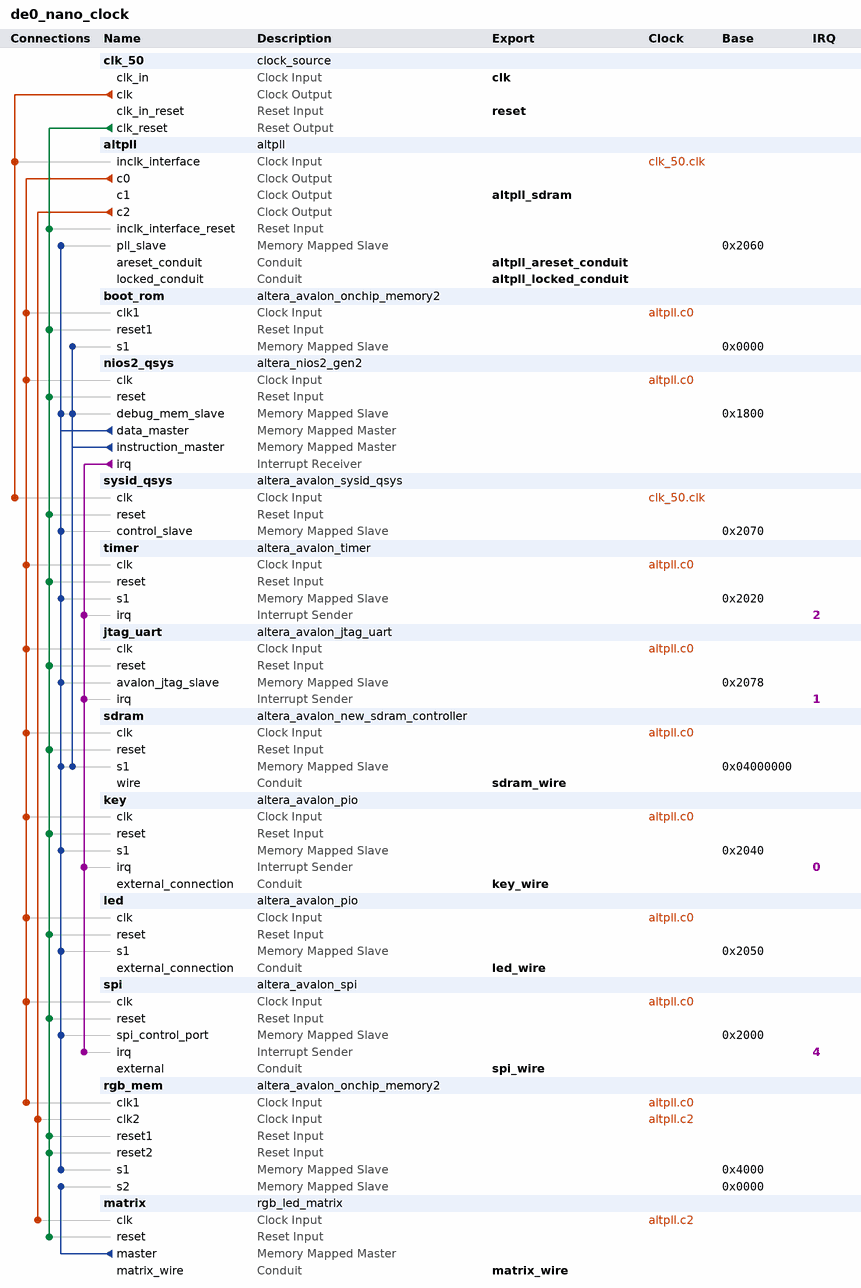
[diagram p0: system contents]
# Platform Designer (Qsys) system de0_nano_clock, Cyclone IV E EP4CE22F17C6
# Parameters at their usual value, and those the tool derives, are not listed.
package require -exact qsys 17.1
create_system de0_nano_clock
set_project_property DEVICE_FAMILY {Cyclone IV E}
set_project_property DEVICE EP4CE22F17C6

add_instance clk_50 clock_source 17.1
set_instance_parameter_value clk_50 clockFrequency 50000000

add_instance altpll altpll 17.1
set_instance_parameter_value altpll CLK0_DIVIDE_BY 2
set_instance_parameter_value altpll CLK0_MULTIPLY_BY 5
set_instance_parameter_value altpll CLK1_DIVIDE_BY 2
set_instance_parameter_value altpll CLK1_DUTY_CYCLE 50
set_instance_parameter_value altpll CLK1_MULTIPLY_BY 5
set_instance_parameter_value altpll CLK1_PHASE_SHIFT 1333
set_instance_parameter_value altpll CLK2_DIVIDE_BY 1
set_instance_parameter_value altpll CLK2_DUTY_CYCLE 50
set_instance_parameter_value altpll CLK2_MULTIPLY_BY 5
set_instance_parameter_value altpll CLK2_PHASE_SHIFT 0
set_instance_parameter_value altpll INCLK0_INPUT_FREQUENCY 20000
set_instance_parameter_value altpll PORT_ARESET PORT_USED
set_instance_parameter_value altpll PORT_LOCKED PORT_USED
set_instance_parameter_value altpll PORT_clk1 PORT_USED
set_instance_parameter_value altpll PORT_clk2 PORT_USED
set_instance_parameter_value altpll PORT_clk3 PORT_UNUSED

add_instance boot_rom altera_avalon_onchip_memory2 17.1
set_instance_parameter_value boot_rom dataWidth 32
set_instance_parameter_value boot_rom dualPort false
set_instance_parameter_value boot_rom initMemContent true
set_instance_parameter_value boot_rom initializationFileName onchip_mem.hex
set_instance_parameter_value boot_rom memorySize 4096
set_instance_parameter_value boot_rom writable false

add_instance nios2_qsys altera_nios2_gen2 17.1
set_instance_parameter_value nios2_qsys dcache_size 2048
set_instance_parameter_value nios2_qsys dividerType srt2
set_instance_parameter_value nios2_qsys exceptionSlave sdram.s1
set_instance_parameter_value nios2_qsys icache_size 4096
set_instance_parameter_value nios2_qsys impl Fast
set_instance_parameter_value nios2_qsys mmu_TLBMissExcSlave sdram.s1
set_instance_parameter_value nios2_qsys mmu_enabled true
set_instance_parameter_value nios2_qsys resetSlave boot_rom.s1

add_instance sysid_qsys altera_avalon_sysid_qsys 17.1
set_instance_parameter_value sysid_qsys id 0

add_instance timer altera_avalon_timer 17.1
set_instance_parameter_value timer period 1
set_instance_parameter_value timer periodUnits MSEC

add_instance jtag_uart altera_avalon_jtag_uart 17.1
set_instance_parameter_value jtag_uart simInteractiveOptions NO_INTERACTIVE_WINDOWS

add_instance sdram altera_avalon_new_sdram_controller 17.1
set_instance_parameter_value sdram TAC 5.5
set_instance_parameter_value sdram TRCD 20.0
set_instance_parameter_value sdram TRP 20.0
set_instance_parameter_value sdram casLatency 3
set_instance_parameter_value sdram columnWidth 9
set_instance_parameter_value sdram dataWidth 16
set_instance_parameter_value sdram generateSimulationModel false
set_instance_parameter_value sdram model single_Micron_MT48LC4M32B2_7_chip
set_instance_parameter_value sdram numberOfBanks 4
set_instance_parameter_value sdram numberOfChipSelects 1
set_instance_parameter_value sdram powerUpDelay 100.0
set_instance_parameter_value sdram refreshPeriod 15.625
set_instance_parameter_value sdram rowWidth 13

add_instance key altera_avalon_pio 17.1
set_instance_parameter_value key captureEdge true
set_instance_parameter_value key direction Input
set_instance_parameter_value key edgeType FALLING
set_instance_parameter_value key generateIRQ true
set_instance_parameter_value key irqType EDGE
set_instance_parameter_value key width 2

add_instance led altera_avalon_pio 17.1
set_instance_parameter_value led direction Output
set_instance_parameter_value led width 8

add_instance spi altera_avalon_spi 17.1
set_instance_parameter_value spi clockPolarity 0
set_instance_parameter_value spi dataWidth 8
set_instance_parameter_value spi masterSPI true
set_instance_parameter_value spi numberOfSlaves 1
set_instance_parameter_value spi targetClockRate 20000000

add_instance rgb_mem altera_avalon_onchip_memory2 17.1
set_instance_parameter_value rgb_mem dataWidth 32
set_instance_parameter_value rgb_mem dualPort true
set_instance_parameter_value rgb_mem enableDiffWidth true
set_instance_parameter_value rgb_mem initMemContent false
set_instance_parameter_value rgb_mem initializationFileName onchip_mem.hex
set_instance_parameter_value rgb_mem memorySize 16384

add_instance matrix rgb_led_matrix 1.0
set_instance_parameter_value matrix color_depth 256
set_instance_parameter_value matrix matrix_height 32
set_instance_parameter_value matrix matrix_width 64
set_instance_parameter_value matrix number_of_matrix 1
set_instance_parameter_value matrix start_addr 0

# connections
add_connection altpll.c0 boot_rom.clk1 clock
add_connection altpll.c0 jtag_uart.clk clock
add_connection altpll.c0 key.clk clock
add_connection altpll.c0 led.clk clock
add_connection altpll.c0 nios2_qsys.clk clock
add_connection altpll.c0 rgb_mem.clk1 clock
add_connection altpll.c0 sdram.clk clock
add_connection altpll.c0 spi.clk clock
add_connection altpll.c0 timer.clk clock
add_connection altpll.c2 matrix.clk clock
add_connection altpll.c2 rgb_mem.clk2 clock
add_connection clk_50.clk altpll.inclk_interface clock
add_connection clk_50.clk sysid_qsys.clk clock
add_connection clk_50.clk_reset altpll.inclk_interface_reset reset
add_connection clk_50.clk_reset boot_rom.reset1 reset
add_connection clk_50.clk_reset jtag_uart.reset reset
add_connection clk_50.clk_reset key.reset reset
add_connection clk_50.clk_reset led.reset reset
add_connection clk_50.clk_reset matrix.reset reset
add_connection clk_50.clk_reset nios2_qsys.reset reset
add_connection clk_50.clk_reset rgb_mem.reset1 reset
add_connection clk_50.clk_reset rgb_mem.reset2 reset
add_connection clk_50.clk_reset sdram.reset reset
add_connection clk_50.clk_reset spi.reset reset
add_connection clk_50.clk_reset sysid_qsys.reset reset
add_connection clk_50.clk_reset timer.reset reset
add_connection matrix.master rgb_mem.s2 avalon
set_connection_parameter_value matrix.master/rgb_mem.s2 baseAddress 0x0000
add_connection nios2_qsys.data_master altpll.pll_slave avalon
set_connection_parameter_value nios2_qsys.data_master/altpll.pll_slave baseAddress 0x2060
add_connection nios2_qsys.data_master jtag_uart.avalon_jtag_slave avalon
set_connection_parameter_value nios2_qsys.data_master/jtag_uart.avalon_jtag_slave baseAddress 0x2078
add_connection nios2_qsys.data_master key.s1 avalon
set_connection_parameter_value nios2_qsys.data_master/key.s1 baseAddress 0x2040
add_connection nios2_qsys.data_master led.s1 avalon
set_connection_parameter_value nios2_qsys.data_master/led.s1 baseAddress 0x2050
add_connection nios2_qsys.data_master nios2_qsys.debug_mem_slave avalon
set_connection_parameter_value nios2_qsys.data_master/nios2_qsys.debug_mem_slave baseAddress 0x1800
add_connection nios2_qsys.data_master rgb_mem.s1 avalon
set_connection_parameter_value nios2_qsys.data_master/rgb_mem.s1 baseAddress 0x4000
add_connection nios2_qsys.data_master sdram.s1 avalon
set_connection_parameter_value nios2_qsys.data_master/sdram.s1 baseAddress 0x04000000
add_connection nios2_qsys.data_master spi.spi_control_port avalon
set_connection_parameter_value nios2_qsys.data_master/spi.spi_control_port baseAddress 0x2000
add_connection nios2_qsys.data_master sysid_qsys.control_slave avalon
set_connection_parameter_value nios2_qsys.data_master/sysid_qsys.control_slave baseAddress 0x2070
add_connection nios2_qsys.data_master timer.s1 avalon
set_connection_parameter_value nios2_qsys.data_master/timer.s1 baseAddress 0x2020
add_connection nios2_qsys.instruction_master boot_rom.s1 avalon
set_connection_parameter_value nios2_qsys.instruction_master/boot_rom.s1 baseAddress 0x0000
add_connection nios2_qsys.instruction_master nios2_qsys.debug_mem_slave avalon
set_connection_parameter_value nios2_qsys.instruction_master/nios2_qsys.debug_mem_slave baseAddress 0x1800
add_connection nios2_qsys.instruction_master sdram.s1 avalon
set_connection_parameter_value nios2_qsys.instruction_master/sdram.s1 baseAddress 0x04000000
add_connection nios2_qsys.irq jtag_uart.irq interrupt
set_connection_parameter_value nios2_qsys.irq/jtag_uart.irq irqNumber 1
add_connection nios2_qsys.irq key.irq interrupt
set_connection_parameter_value nios2_qsys.irq/key.irq irqNumber 0
add_connection nios2_qsys.irq spi.irq interrupt
set_connection_parameter_value nios2_qsys.irq/spi.irq irqNumber 4
add_connection nios2_qsys.irq timer.irq interrupt
set_connection_parameter_value nios2_qsys.irq/timer.irq irqNumber 2

# exported interfaces
add_interface altpll_areset_conduit conduit end
set_interface_property altpll_areset_conduit EXPORT_OF altpll.areset_conduit
add_interface altpll_locked_conduit conduit end
set_interface_property altpll_locked_conduit EXPORT_OF altpll.locked_conduit
add_interface altpll_sdram clock source
set_interface_property altpll_sdram EXPORT_OF altpll.c1
add_interface clk clock sink
set_interface_property clk EXPORT_OF clk_50.clk_in
add_interface key_wire conduit end
set_interface_property key_wire EXPORT_OF key.external_connection
add_interface led_wire conduit end
set_interface_property led_wire EXPORT_OF led.external_connection
add_interface matrix_wire conduit end
set_interface_property matrix_wire EXPORT_OF matrix.matrix_wire
add_interface reset reset sink
set_interface_property reset EXPORT_OF clk_50.clk_in_reset
add_interface sdram_wire conduit end
set_interface_property sdram_wire EXPORT_OF sdram.wire
add_interface spi_wire conduit end
set_interface_property spi_wire EXPORT_OF spi.external

set_interconnect_requirement {$system} qsys_mm.clockCrossingAdapter HANDSHAKE
set_interconnect_requirement {$system} qsys_mm.enableEccProtection FALSE
set_interconnect_requirement {$system} qsys_mm.insertDefaultSlave FALSE
set_interconnect_requirement {$system} qsys_mm.maxAdditionalLatency 1

save_system de0_nano_clock.qsys
